# Altium schematic sheet schema5.SchDoc
size A3; ApprovedBy: CdB; CheckedBy: CdB; DrawnBy: RT; Engineer: CdB; Organization: Faber Electronics B.V.; Address1: Th. Dobbeweg 1,; Address2: 6883 GN Velp,; Address3: Netherlands; Address4: T: 026-38 46 800; DocumentNumber: 5; Revision: 2.1.4; SheetNumber: 5; SheetTotal: 6; Status: Final; PageSetup: Record=PageOptions|CenterHorizontal=True|CenterVertical=True|PrintScale=1.01|XCorrection=1.00|YCorrection=1.00|PrintKind=1|BorderSize=5000000|LeftOffset=0|BottomOffset=0|Orientation=2|PaperLength=1000|PaperWidth=1000|Scale=100|PaperSource=7|PrintQuality=1200|MediaType=1|DitherType=10|PaperKind=A3 (297 x 420mm)|PrintScaleMode=1
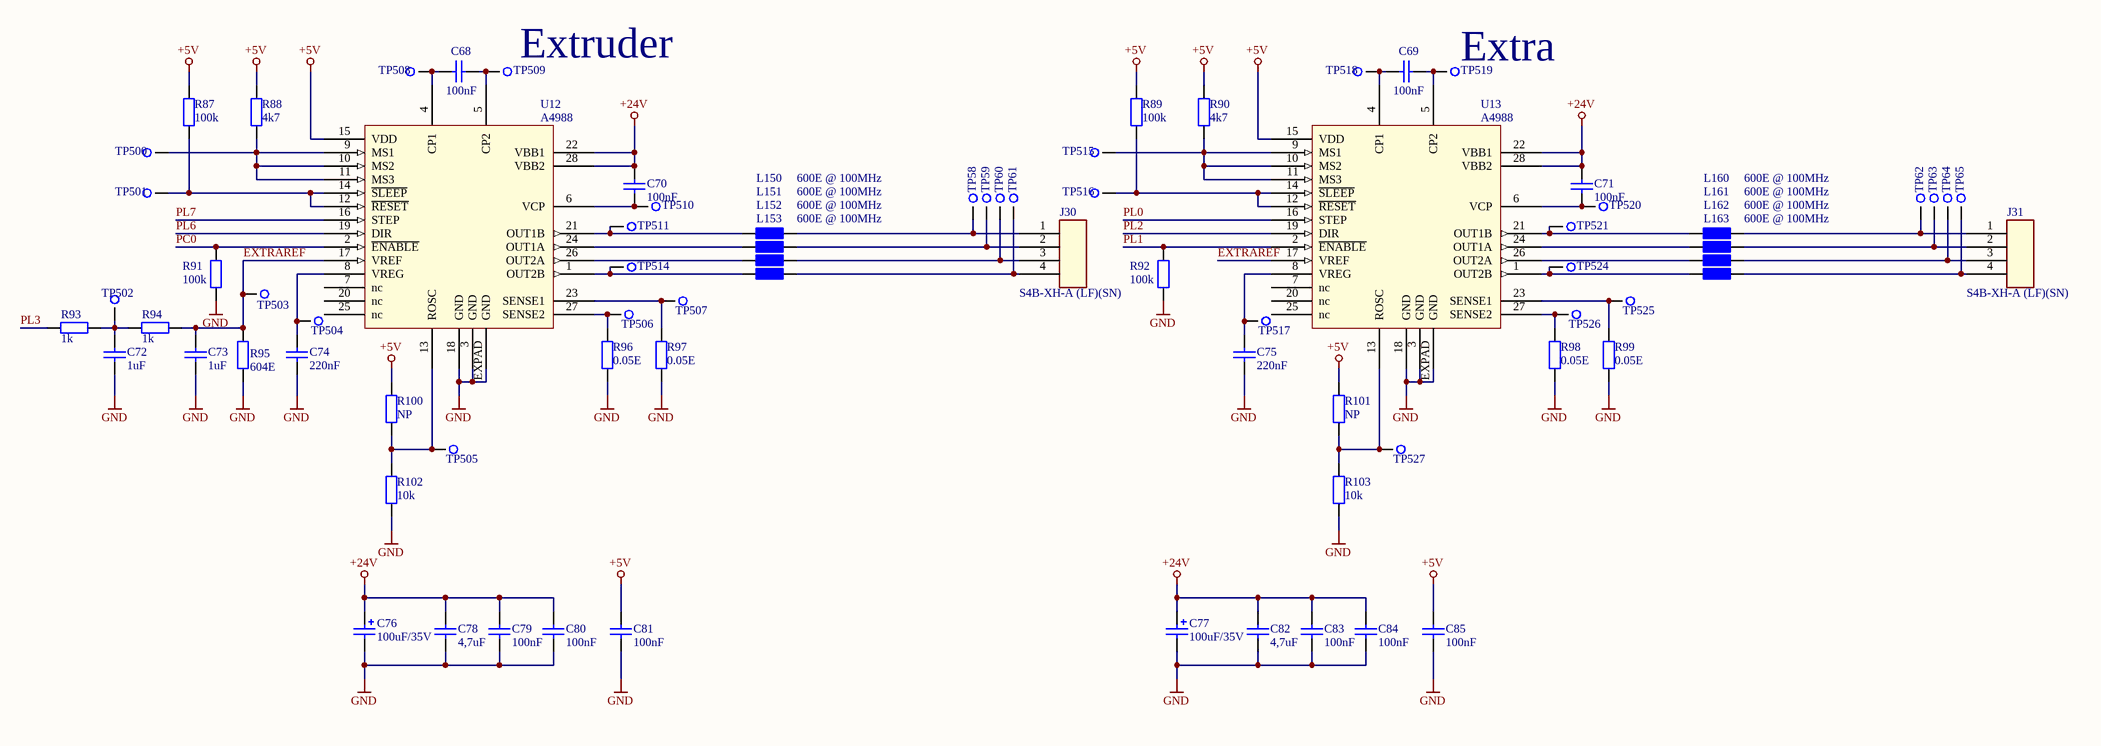
[diagram p0: schema5.SchDoc]

## Parts
C68  100nF  [C0603]
C69  100nF  [C0603]
C70  100nF  [C0603]
C71  100nF  [C0603]
C72  1uF  [C0603]
C73  1uF  [C0603]
C74  220nF  [C0603]
C75  220nF  [C0603]
C76  100uF/35V  [ELCO Case D]
C77  100uF/35V  [ELCO Case D]
C78  4,7uF  [C1206]
C79  100nF  [C0603]
C80  100nF  [C0603]
C81  100nF  [C0603]
C82  4,7uF  [C1206]
C83  100nF  [C0603]
C84  100nF  [C0603]
C85  100nF  [C0603]
J30  S4B-XH-A (LF)(SN)  [S4B-XH-A (LF)(SN)]
J31  S4B-XH-A (LF)(SN)  [S4B-XH-A (LF)(SN)]
L150  600E @ 100MHz  [R1206]
L151  600E @ 100MHz  [R1206]
L152  600E @ 100MHz  [R1206]
L153  600E @ 100MHz  [R1206]
L160  600E @ 100MHz  [R1206]
L161  600E @ 100MHz  [R1206]
L162  600E @ 100MHz  [R1206]
L163  600E @ 100MHz  [R1206]
R87  100k  [R0603]
R88  4k7  [R0603]
R89  100k  [R0603]
R90  4k7  [R0603]
R91  100k  [R0603]
R92  100k  [R0603]
R93  1k  [R0603]
R94  1k  [R0603]
R95  604E  [R0603]
R96  0.05E  [R0805]
R97  0.05E  [R0805]
R98  0.05E  [R0805]
R99  0.05E  [R0805]
R100  NP  [R0603]
R101  NP  [R0603]
R102  10k  [R0603]
R103  10k  [R0603]
TP58  Testpoint  [Testpoint]  (value not drawn)
TP59  Testpoint  [Testpoint]  (value not drawn)
TP60  Testpoint  [Testpoint]  (value not drawn)
TP61  Testpoint  [Testpoint]  (value not drawn)
TP62  Testpoint  [Testpoint]  (value not drawn)
TP63  Testpoint  [Testpoint]  (value not drawn)
TP64  Testpoint  [Testpoint]  (value not drawn)
TP65  Testpoint  [Testpoint]  (value not drawn)
TP500  Testpoint 1mm  [Testpoint 1mm]  (value not drawn)
TP501  Testpoint 1mm  [Testpoint 1mm]  (value not drawn)
TP502  Testpoint 1mm  [Testpoint 1mm]  (value not drawn)
TP503  Testpoint 1mm  [Testpoint 1mm]  (value not drawn)
TP504  Testpoint 1mm  [Testpoint 1mm]  (value not drawn)
TP505  Testpoint 1mm  [Testpoint 1mm]  (value not drawn)
TP506  Testpoint 1mm  [Testpoint 1mm]  (value not drawn)
TP507  Testpoint 1mm  [Testpoint 1mm]  (value not drawn)
TP508  Testpoint 1mm  [Testpoint 1mm]  (value not drawn)
TP509  Testpoint 1mm  [Testpoint 1mm]  (value not drawn)
TP510  Testpoint 1mm  [Testpoint 1mm]  (value not drawn)
TP511  Testpoint 1mm  [Testpoint 1mm]  (value not drawn)
TP514  Testpoint 1mm  [Testpoint 1mm]  (value not drawn)
TP515  Testpoint 1mm  [Testpoint 1mm]  (value not drawn)
TP516  Testpoint 1mm  [Testpoint 1mm]  (value not drawn)
TP517  Testpoint 1mm  [Testpoint 1mm]  (value not drawn)
TP518  Testpoint 1mm  [Testpoint 1mm]  (value not drawn)
TP519  Testpoint 1mm  [Testpoint 1mm]  (value not drawn)
TP520  Testpoint 1mm  [Testpoint 1mm]  (value not drawn)
TP521  Testpoint 1mm  [Testpoint 1mm]  (value not drawn)
TP524  Testpoint 1mm  [Testpoint 1mm]  (value not drawn)
TP525  Testpoint 1mm  [Testpoint 1mm]  (value not drawn)
TP526  Testpoint 1mm  [Testpoint 1mm]  (value not drawn)
TP527  Testpoint 1mm  [Testpoint 1mm]  (value not drawn)
U12  A4988  [QFN50P500X500X100-28-EX]
U13  A4988  [QFN50P500X500X100-28-EX]

## Nets
+5V: C81.2 C85.2 R87.2 R88.2 R89.2 R90.2 R100.2 R101.2 U12.15(VDD) U13.15(VDD)
+24V: C70.2 C71.2 C76.1 C77.1 C78.2 C79.2 C80.2 C82.2 C83.2 C84.2 U12.22(VBB1) U12.28(VBB2) U13.22(VBB1) U13.28(VBB2)
GND: C72.1 C73.1 C74.1 C75.1 C76.2 C77.2 C78.1 C79.1 C80.1 C81.1 C82.1 C83.1 C84.1 C85.1 R91.2 R92.2 R95.1 R96.1 R97.1 R98.1 R99.1 R102.1 R103.1 U12.3(GND) U12.18(GND) U12.EXPAD(GND) U13.3(GND) U13.18(GND) U13.EXPAD(GND)
EXTRAREF: C73.2 R94.2 R95.2 TP503.1 U12.17(VREF) U13.17(VREF)
PC0: R91.1 U12.2(~{ENABLE})
PL0: U13.16(STEP)
PL1: R92.1 U13.2(~{ENABLE})
PL2: U13.19(DIR)
PL3: R93.1
PL6: U12.19(DIR)
PL7: U12.16(STEP)
NetC68_1: C68.1 TP508.1 U12.4(CP1)
NetC68_2: C68.2 TP509.1 U12.5(CP2)
NetC69_1: C69.1 TP518.1 U13.4(CP1)
NetC69_2: C69.2 TP519.1 U13.5(CP2)
NetC70_1: C70.1 TP510.1 U12.6(VCP)
NetC71_1: C71.1 TP520.1 U13.6(VCP)
NetC72_2: C72.2 R93.2 R94.1 TP502.1
NetC74_2: C74.2 TP504.1 U12.8(VREG)
NetC75_2: C75.2 TP517.1 U13.8(VREG)
NetJ30_1: J30.1 L150.2 TP58.1
NetJ30_2: J30.2 L151.2 TP59.1
NetJ30_3: J30.3 L152.2 TP60.1
NetJ30_4: J30.4 L153.2 TP61.1
NetJ31_1: J31.1 L160.2 TP62.1
NetJ31_2: J31.2 L161.2 TP63.1
NetJ31_3: J31.3 L162.2 TP64.1
NetJ31_4: J31.4 L163.2 TP65.1
NetL150_1: L150.1 TP511.1 U12.21(OUT1B)
NetL151_1: L151.1 U12.24(OUT1A)
NetL152_1: L152.1 U12.26(OUT2A)
NetL153_1: L153.1 TP514.1 U12.1(OUT2B)
NetL160_1: L160.1 TP521.1 U13.21(OUT1B)
NetL161_1: L161.1 U13.24(OUT1A)
NetL162_1: L162.1 U13.26(OUT2A)
NetL163_1: L163.1 TP524.1 U13.1(OUT2B)
NetR87_1: R87.1 TP501.1 U12.12(~{RESET}) U12.14(~{SLEEP})
NetR88_1: R88.1 TP500.1 U12.9(MS1) U12.10(MS2) U12.11(MS3)
NetR89_1: R89.1 TP516.1 U13.12(~{RESET}) U13.14(~{SLEEP})
NetR90_1: R90.1 TP515.1 U13.9(MS1) U13.10(MS2) U13.11(MS3)
NetR96_2: R96.2 TP506.1 U12.27(SENSE2)
NetR97_2: R97.2 TP507.1 U12.23(SENSE1)
NetR98_2: R98.2 TP526.1 U13.27(SENSE2)
NetR99_2: R99.2 TP525.1 U13.23(SENSE1)
NetR100_1: R100.1 R102.2 TP505.1 U12.13(ROSC)
NetR101_1: R101.1 R103.2 TP527.1 U13.13(ROSC)

Not connected (* = marked no-connect by the designer): U12 7(nc) 20(nc) 25(nc); U13 7(nc) 20(nc) 25(nc)

## Notes on the sheet
- (near TP509) Extruder
- (near TP519) Extra
- Project name
- Document Name
- Revision:
- Date:
- Status:
- Engineer:
- Drawing by:
- Time:
- Approved By:
- Checked By:
- Date of approval:
- Sheet
- of
- Size:
- A3
- File:
- F: 026-36 48 244

## Library data of the parts
C68-C71 C79-C81 C83-C85 = Library_CAP-0002: RO X7R 100nF 10% 50V 0603; Faber ItemCode: 45068500; ID: Library_CAP-0002; Value: 100nF
C72 C73 = Library_CAP-0006: RO X5R 1uF 10% 10V 0603; Faber ItemCode: 36310600; ID: Library_CAP-0006; Value: 1uF
C74 C75 = Library_CAP-0001: RO X7R 220nF 10% 25V  0603; Faber ItemCode: 36126300; ID: Library_CAP-0001; Value: 220nF
C76 C77 = Library_CAP-0004: RO ELCO 100uF 20% 35V CASE-D EEEFP PAN; Faber ItemCode: 36865800; ID: Library_CAP-0004; Value: 100uF/35V
C78 C82 = Library_CAP-0003: RO X7R 4,7uF 10% 50V 1206; Faber ItemCode: 35404600; ID: Library_CAP-0003; Value: 4,7uF
J30 J31 = Library_CON-0005: RO CONN PR 4p HKS S4B-XH-A (LF)(SN) JST; Mfg: JST (JAPAN SOLDERLESS TERMINALS); Faber ItemCode: 36926500; ID: Library_CON-0005; Mfg code: S4B-XH-A (LF)(SN); Value: S4B-XH-A (LF)(SN)
L150-L153 L160-L163 = Ferriet Bead 600E: FERRIET 742792118 1206 Wurth Elektronik; Mfg: Wurth Elektronics; Mfg code: 1800374; ID: -; Faber ItemCode: -; Info: Ferriet; Value: 600E @ 100MHz
R87 R89 R91 R92 = Library_RES-0005: RO RES 100k0 1% 0,063W  0603; Faber ItemCode: 36257800; ID: Library_RES-0005; Info: Resistor; Value: 100k
R88 R90 = Library_RES-0002: RO RES 4k70 1% 0,063W  0603; Faber ItemCode: 36257400; ID: Library_RES-0002; Info: Resistor; Value: 4k7
R93 R94 = Library_RES-0004: RO RES 1k0 1% 0,1W  0603; Faber ItemCode: 34637900; ID: Library_RES-0004; Info: Resistor; Value: 1k
R95 = Library_RES-0018: RO RES 604E 1% 0,063W 0603; Mfg: VISHAY DRALORIC; Mfg code: CRCW0603604RFKEA; Faber ItemCode: 36932600; ID: Library_RES-0018; Info: Resistor; Value: 604E
R96-R99 = Library_RES-0013: RO RES 0E05 1% 0,125W 0805; Mfg: BOURNS; Mfg code: CRL0805-FW-R050ELF; Faber ItemCode: 36925700; ID: Library_RES-0013; Info: Resistor; Value: 0.05E
R100 R101 = Library_RES-0001
R102 R103 = Library_RES-0001: RO RES 10k0 1% 0,063W  0603; Faber ItemCode: 36084500; ID: Library_RES-0001; Info: Resistor; Value: 10k
TP58-TP65 = Library_MISC-0001: Info: Testpoint, 2mm, round; ID: Library_MISC-0001; Faber ItemCode: -; Mfg: -; Mfg code: -; Value: Testpoint
TP500-TP511 TP514-TP521 TP524-TP527 = Testpoint 1mm: ID: Library_MISC-0001; Faber ItemCode: -; Mfg: -; Mfg code: -; Info: Testpoint 1mm; Value: Testpoint 1mm
U12 U13 = Library_ICS-0002: RO IC A4988 QFN-28 ALLEGRO; Mfg code: A4988SETTR-T; Info: DMOS Microstepping Driver with Translator and Overcurrent Protection; Faber ItemCode: 36921600; ID: Library_ICS-0002; Mfg: Allegro; Value: A4988